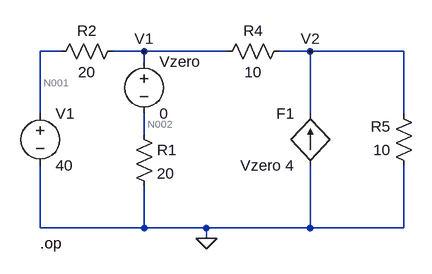
[diagram p0: schematic dependent_source_5.asc]
dependent_source_5.asc, the LTspice schematic file:
Version 4
SHEET 1 880 680
WIRE -48 32 -80 32
WIRE 80 32 32 32
WIRE 208 32 80 32
WIRE 336 32 288 32
WIRE 480 32 336 32
WIRE 80 48 80 32
WIRE -80 128 -80 32
WIRE 336 128 336 32
WIRE 480 128 480 32
WIRE 80 160 80 128
WIRE -80 304 -80 208
WIRE 80 304 80 240
WIRE 80 304 -80 304
WIRE 176 304 80 304
WIRE 336 304 336 208
WIRE 336 304 176 304
WIRE 480 304 480 208
WIRE 480 304 336 304
WIRE 176 320 176 304
FLAG 176 320 0
FLAG 80 32 V1
FLAG 336 32 V2
SYMBOL res 64 144 R0
SYMATTR InstName R1
SYMATTR Value 20
SYMBOL res -64 48 R270
WINDOW 0 32 56 VTop 2
WINDOW 3 0 56 VBottom 2
SYMATTR InstName R2
SYMATTR Value 20
SYMBOL res 192 48 R270
WINDOW 0 32 56 VTop 2
WINDOW 3 0 56 VBottom 2
SYMATTR InstName R4
SYMATTR Value 10
SYMBOL res 496 224 R180
WINDOW 0 36 76 Left 2
WINDOW 3 36 40 Left 2
SYMATTR InstName R5
SYMATTR Value 10
SYMBOL voltage -80 112 R0
SYMATTR InstName V1
SYMATTR Value 40
SYMBOL voltage 80 32 R0
SYMATTR InstName Vzero
SYMATTR Value 0
SYMBOL f 336 208 R180
WINDOW 0 24 80 Left 2
WINDOW 3 24 0 Left 2
SYMATTR InstName F1
SYMATTR Value Vzero 4
TEXT -80 328 Left 2 !.op

The netlist it stands for:
* dependent_source_5.asc
R1 N002 0 20
R2 N001 V1 20
R4 V1 V2 10
R5 0 V2 10
V1 N001 0 40
Vzero V1 N002 0
F1 0 V2 Vzero 4
.op
.backanno
.end

* Results of the author's LTspice run, read from the files saved beside the schematic
* Operating Point:
*   V(n002) = 40 V
*   V(n001) = 40 V
*   V(v1) = 40 V
*   V(v2) = 60 V
*   I(F1) = 8 A
*   I(R5) = -6 A
*   I(R4) = -2 A
*   I(R2) = 0 A
*   I(R1) = 2 A
*   I(Vzero) = 2 A
*   I(V1) = 0 A